# EAGLE design Teensy_3_1 XBee Adapter (EAGLE 7.2.0)
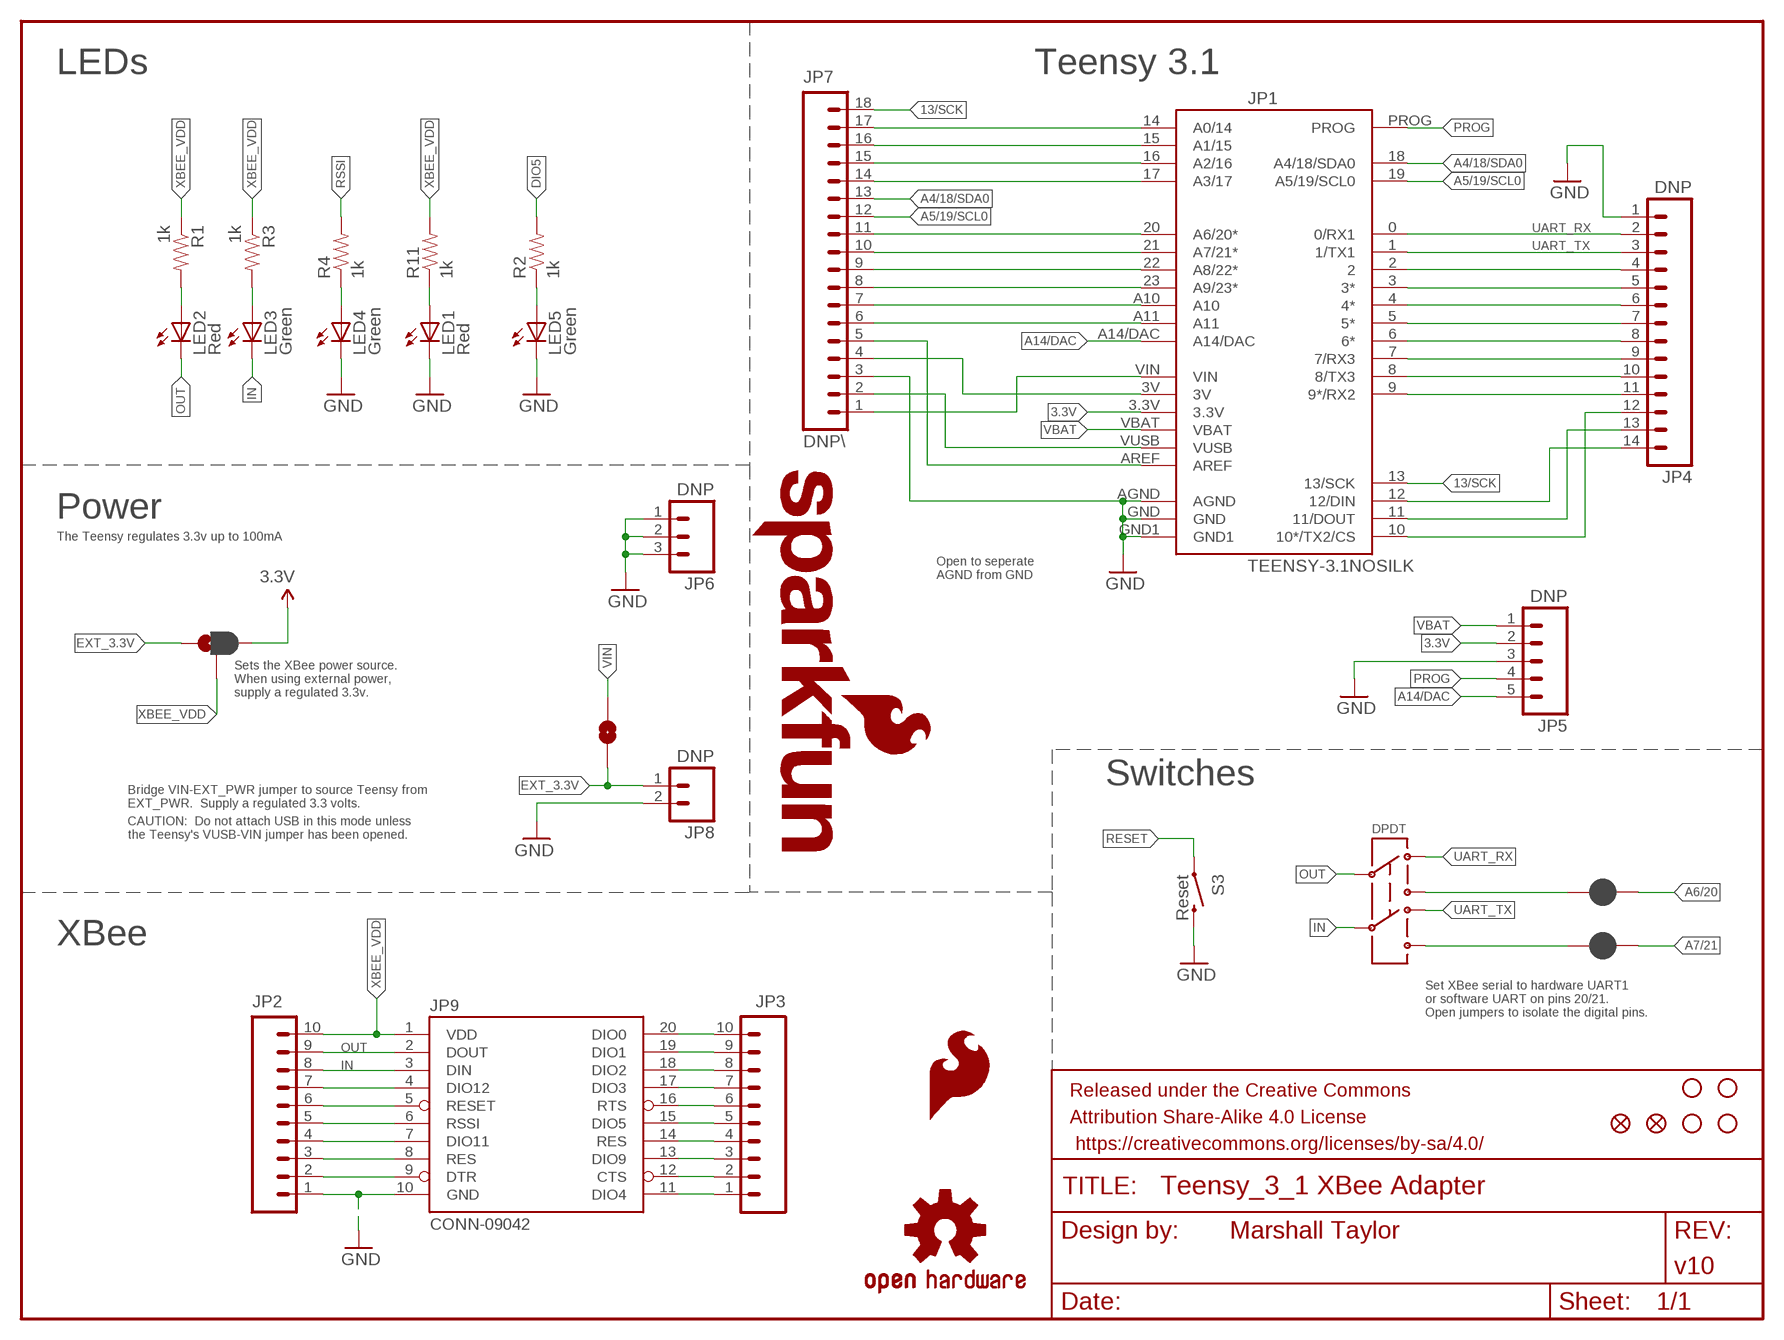
[diagram p0: schematic, sheet 1]

## Parts
FID1  FIDUCIAL1X2  [FIDUCIAL-1X2]
FID2  FIDUCIAL1X2  [FIDUCIAL-1X2]
FRAME1  FRAME-LETTER  [CREATIVE_COMMONS]
JP1  TEENSY-3.1NOSILK  [TEENSY-3.1_NOSILK]
JP2  M10NO_SILK_PTH_FEMALE  [1X10_NO_SILK]
JP3  M10NO_SILK_PTH_FEMALE  [1X10_NO_SILK]
JP4  DNP  M14  [1X14]
JP5  DNP  M05PTH  [1X05]
JP6  DNP  M03PTH  [1X03]
JP7  DNP\  M18_  [1X18]
JP8  DNP  M02PTH  [1X02]
JP9  CONN-09042  XBEE-1B3  [XBEE-SMD]
LED1  Red  LED-RED0603  [LED-0603]
LED2  Red  LED-RED0603  [LED-0603]
LED3  Green  LED-GREEN0603  [LED-0603]
LED4  Green  LED-GREEN0603  [LED-0603]
LED5  Green  LED-GREEN0603  [LED-0603]
LOGO1  SFE_LOGO_FLAME.2_INCH  [SFE_LOGO_FLAME_.2]
LOGO2  OSHW-LOGOM  [OSHW-LOGO-M]
LOGO3  SFE_LOGO_NAME_FLAME.2_INCH  [SFE_LOGO_NAME_FLAME_.2]
R1  1k  1KOHM1/10W1%(0603)  [0603-RES]
R2  1k  1KOHM1/10W1%(0603)  [0603-RES]
R3  1k  1KOHM1/10W1%(0603)  [0603-RES]
R4  1k  1KOHM1/10W1%(0603)  [0603-RES]
R11  1k  1KOHM1/10W1%(0603)  [0603-RES]
S2  DPDT  SWITCH-DPDTAYZ0202  [AYZ0202]
S3  Reset  SWITCH-MOMENTARY-2SMD  [TACTILE-SWITCH-SMD]
SJ1  D_TX  JUMPER-PAD-2-NC_BY_PASTE  [PAD-JUMPER-2-NC_BY_PASTE_YES_SILK]
SJ3  D_RX  JUMPER-PAD-2-NC_BY_PASTE  [PAD-JUMPER-2-NC_BY_PASTE_YES_SILK]
SJ4  JUMPER-PAD-3-2OF3_NC_BY_PASTE  [PAD-JUMPER-3-2OF3_NC_BY_PASTE_YES_SILK_FULL_BOX]
SJ5  EXT_JPR  JUMPER-PAD-2-NOYES_SILK  [PAD-JUMPER-2-NO_YES_SILK]
STANDOFF1  STAND-OFF  [STAND-OFF]
STANDOFF2  STAND-OFF  [STAND-OFF]
STANDOFF3  STAND-OFF  [STAND-OFF]
STANDOFF4  STAND-OFF  [STAND-OFF]

## Nets
2: JP1.2 JP4.4
3: JP1.3(3*) JP4.5
3.3V: JP1.3.3V JP5.2 SJ4.3
3V: JP1.3V JP7.4
4: JP1.4(4*) JP4.6
5: JP1.5(5*) JP4.7
6: JP1.6(6*) JP4.8
7/RX3: JP1.7(7/RX3) JP4.9
8/TX3: JP1.8(8/TX3) JP4.10
9/RX2: JP1.9(9*/RX2) JP4.11
10/TX2/CS: JP1.10(10*/TX2/CS) JP4.12
11/DOUT: JP1.11(11/DOUT) JP4.13
12/DIN: JP1.12(12/DIN) JP4.14
13/SCK: JP1.13(13/SCK) JP7.18
A0/14: JP1.14(A0/14) JP7.17
A1/15: JP1.15(A1/15) JP7.16
A2/16: JP1.16(A2/16) JP7.15
A3/17: JP1.17(A3/17) JP7.14
A4/18/SDA0: JP1.18(A4/18/SDA0) JP7.13
A5/19/SCL0: JP1.19(A5/19/SCL0) JP7.12
A6/20: JP1.20(A6/20*) JP7.11 SJ3.1
A7/21: JP1.21(A7/21*) JP7.10 SJ1.1
A8/22: JP1.22(A8/22*) JP7.9
A9/23: JP1.23(A9/23*) JP7.8
A10: JP1.A10 JP7.7
A11: JP1.A11 JP7.6
A14/DAC: JP1.A14/DAC JP5.5
AREF: JP1.AREF JP7.5
CTS: JP3.2 JP9.12(CTS)
DIO0: JP3.10 JP9.20(DIO0)
DIO1: JP3.9 JP9.19(DIO1)
DIO2: JP3.8 JP9.18(DIO2)
DIO3: JP3.7 JP9.17(DIO3)
DIO4: JP3.1 JP9.11(DIO4)
DIO5: JP3.5 JP9.15(DIO5) R2.2
DIO9: JP3.3 JP9.13(DIO9)
DIO11: JP2.4 JP9.7(DIO11)
DIO12: JP2.7 JP9.4(DIO12)
DTR: JP2.2 JP9.9(DTR)
EXT_3.3V [vcc]: JP8.1 SJ4.1 SJ5.2
GND: JP1.AGND JP1.GND JP1.GND1 JP2.1 JP4.1 JP5.3 JP6.1 JP6.2 JP6.3 JP7.3 JP8.2 JP9.10(GND) LED1.C LED4.C LED5.C S3.3
IN: JP2.8 JP9.3(DIN) LED3.C S2.5
N$12: LED1.A R11.1
N$17: LED2.A R1.2
N$19: LED3.A R3.2
N$43: LED4.A R4.1
N$139: LED5.A R2.1
N$140: S2.6 SJ1.2
N$141: S2.3 SJ3.2
OUT: JP2.9 JP9.2(DOUT) LED2.C S2.2
PROG: JP1.PROG JP5.4
RES: JP2.3 JP9.8(RES)
RES2: JP3.4 JP9.14(RES)
RESET: JP2.6 JP9.5(RESET) S3.1
RSSI: JP2.5 JP9.6(RSSI) R4.2
RTS: JP3.6 JP9.16(RTS)
UART_RX: JP1.0(0/RX1) JP4.2 S2.1
UART_TX: JP1.1(1/TX1) JP4.3 S2.4
VBAT: JP1.VBAT JP5.1
VIN: JP1.VIN JP7.1 SJ5.1
VUSB: JP1.VUSB JP7.2
XBEE_VDD: JP2.10 JP9.1(VDD) R1.1 R3.1 R11.2 SJ4.2

## Notes on the sheet
- LEDs | Teensy 3.1
- Power
- The Teensy regulates 3.3v up to 100mA
- Open to seperate 
  AGND from GND
- Sets the XBee power source.
  When using external power,
  supply a regulated 3.3v.
- Switches
- Bridge VIN-EXT_PWR jumper to source Teensy from
  EXT_PWR.  Supply a regulated 3.3 volts.
- DPDT
- CAUTION:  Do not attach USB in this mode unless
  the Teensy's VUSB-VIN jumper has been opened.
- XBee
- Set XBee serial to hardware UART1
  or software UART on pins 20/21.
  Open jumpers to isolate the digital pins.

## Library data of the parts
FID1 FID2 = SparkFun-Aesthetics:FIDUCIAL: Fiducial Alignment Points Various fiducial points for machine vision alignment.
FRAME1 = SparkFun-Aesthetics:FRAME-LETTER: Schematic Frame Standard 8.5x11 US Letter frame; DESIGNER: Marshall Taylor; VERSION: v10
JP1 = Testing:TEENSY-3.1
JP2 JP3 = SparkFun-Connectors:M10: Header 10 Standard 10-pin 0.1" header. Use with straight break away headers (SKU : PRT-00116), right angle break away headers (PRT-00553), swiss pins (PRT-00743), machine pins (PRT-00117), and female headers (PRT-00115).; PROD_ID: CONN-11563
JP4 = SparkFun-Connectors:M14: Header 14 Standard 14-pin 0.1" header. Use with straight break away headers (SKU : PRT-00116), right angle break away headers (PRT-00553), swiss pins (PRT-00743), machine pins (PRT-00117), and female headers (PRT-00115).
JP5 = SparkFun-Connectors:M05: Header 5 Standard 5-pin 0.1" header. Use with straight break away headers (SKU : PRT-00116), right angle break away headers (PRT-00553), swiss pins (PRT-00743), machine pins (PRT-00117), and female headers (PRT-00115). Molex polarized connector foot print use with SKU : PRT-08230 with associated crimp pins and housings.
JP6 = SparkFun-Connectors:M03: Header 3 Standard 3-pin 0.1" header. Use with straight break away headers (SKU : PRT-00116), right angle break away headers (PRT-00553), swiss pins (PRT-00743), machine pins (PRT-00117), and female headers (PRT-00115). Molex polarized connector foot print use with SKU : PRT-08232 with associated crimp pins and housings.
JP7 = SparkFun-Connectors:M18: 1x18 .1" header
JP8 = SparkFun-Connectors:M02: Standard 2-pin 0.1" header. Use with - straight break away headers ( PRT-00116) - right angle break away headers (PRT-00553) - swiss pins (PRT-00743) - machine pins (PRT-00117) - female headers (PRT-00115) Molex polarized connector foot print use with: PRT-08233 with associated crimp pins and housings. 2.54_SCREWTERM for use with PRT-10571. 3.5mm Screw Terminal footprints for PRT-08084 5mm Screw Terminal footprints for use with PRT-08432
JP9 = SparkFun-RF:XBEE-1: Xbee module footprints; PROD_ID: CONN-09042
LED1 LED2 = SparkFun-LED:LED-RED: Assorted Red LEDs LilyPad 1206- DIO-09912 1206- DIO-00809 0603- DIO-00819; PROD_ID: DIO-00819; VALUE: RED
LED3-LED5 = SparkFun-LED:LED-GREEN: Various green LEDs Green LEDs used in SFE Production 0603- DIO-00821 LARGE- DIO-00862 LILYPAD- DIO-09910; PROD_ID: DIO-00821; VALUE: GREEN
LOGO1 = SparkFun-Aesthetics:SFE_LOGO_FLAME: SFE Logo, flame only This is the SparkFun flame logo. The logo on the schematic will always be the same size; the package variant is the height of the flame. Default layer for the logo on the board is tSilk.
LOGO2 = SparkFun-Aesthetics:OSHW-LOGO: Open Source Hardware Logo This logo indicates the piece of hardware it is found on incorporates a OSHW license and/or adheres to the definition of open source hardware found here: http://freedomdefined.org/OSHW
LOGO3 = SparkFun-Aesthetics:SFE_LOGO_NAME_FLAME: SFE Logo, name and flame This is the SparkFun full logo. The logo on the schematic will always be the same size; the package variant is the height of the flame part of the logo. Default layer for the logo on the board is tSilk.
R1-R4 R11 = SparkFun-Resistors:1KOHM1/10W1%(0603): RES-07856; PROD_ID: RES-07856; VALUE: 1K
S2 = SparkFun-Electromechanical:SWITCH-DPDT: DPDT Version of the COM-00597; PROD_ID: SWCH-08179
S3 = SparkFun-Electromechanical:SWITCH-MOMENTARY-2: Various NO switches- pushbuttons, reed, etc; PROD_ID: SWCH-08247
SJ1 SJ3 = SparkFun-Passives:JUMPER-PAD-2-NC_BY_PASTE
SJ4 = SparkFun-Passives:JUMPER-PAD-3-2OF3_NC_BY_PASTE
SJ5 = SparkFun-Passives:JUMPER-PAD-2-NO
STANDOFF1-STANDOFF4 = SparkFun-Electromechanical:STAND-OFF: #4 Stand Off This is the mechanical footprint for a #4 phillips button head screw. Use the keepout ring to avoid running the screw head into surrounding components. SKU : PRT-00447

## Net classes
0 default: width 0.203 mm
1 vcc: width 0.254 mm

## Board
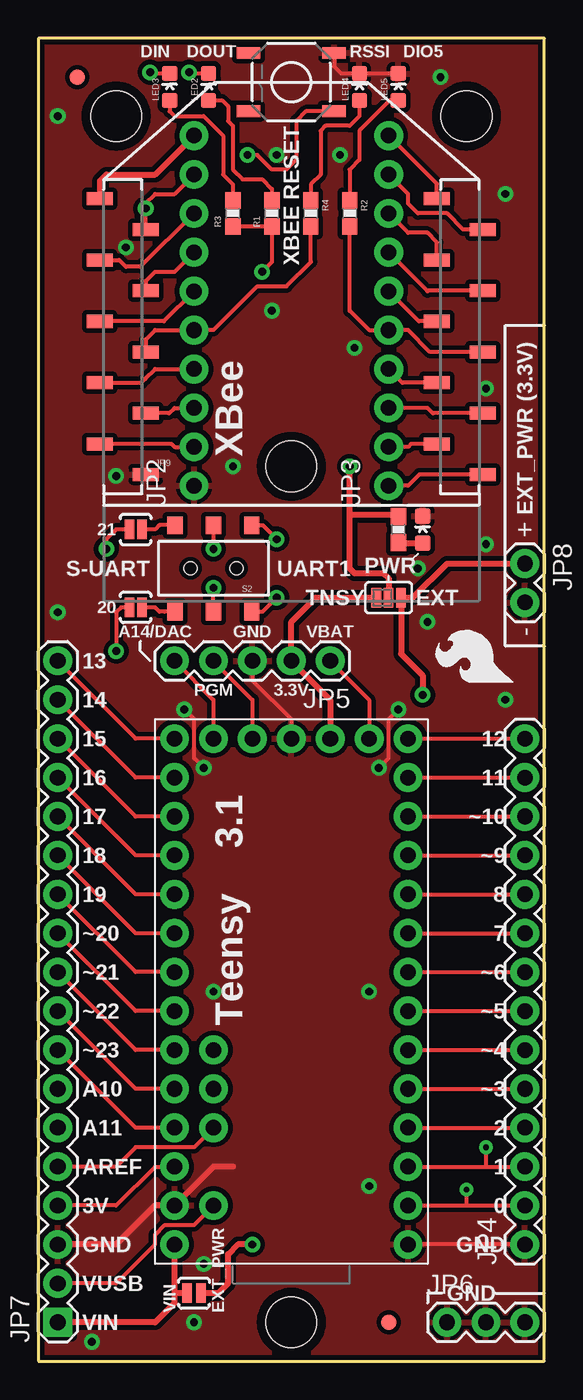
[diagram p1: board, top side]
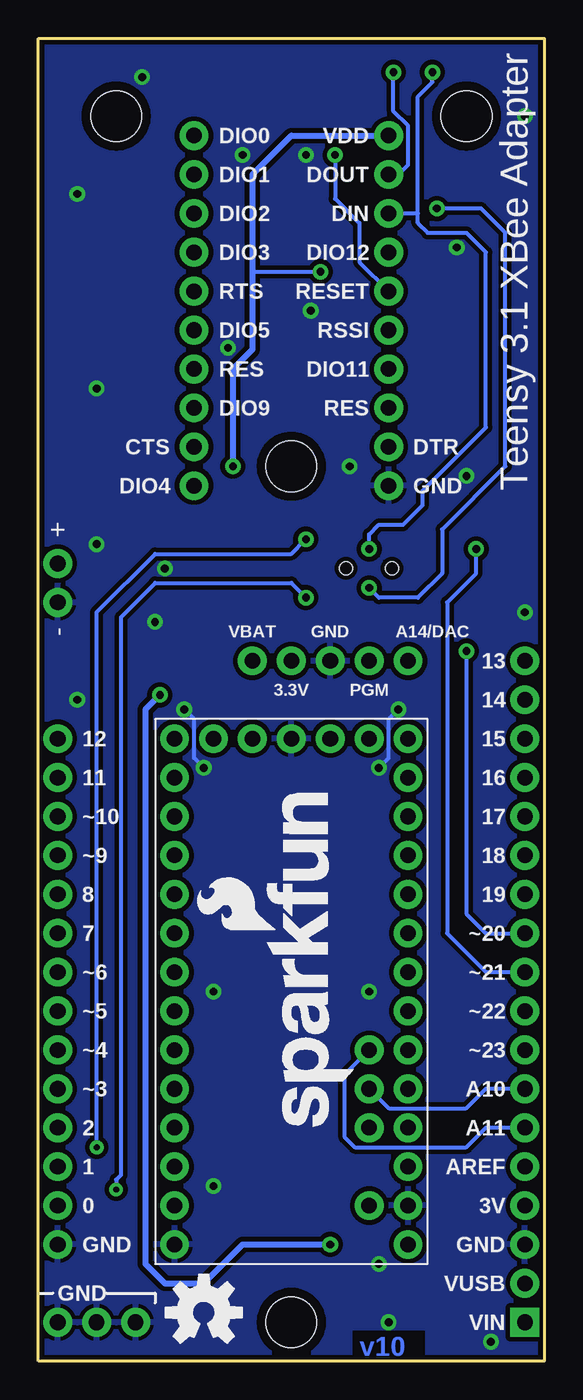
[diagram p2: board, bottom side, seen from below]

Size 33.02 x 86.36 mm. Coordinates in mm from the lower left corner, seen from the top.
Outline: 0,0 33.02,0 33.02,86.36 0,86.36 0,0
Copper layers (1*16): Top 0.035mm / dielectric 1.5mm / Bottom 0.035mm
Design rules "SparkFun-2-layer": minimum track width 7mil, minimum drill 15mil, track to track 8mil, track to pad 8mil, pad to pad 8mil, via to via 8mil, smd to smd 8mil, copper to edge 8mil, drill to drill 8mil, minimum pad ring 12mil, minimum via ring 10mil, stop-mask expansion 4mil, vias tented up to drill 20mil, thermal gap 10mil

### Footprints (pad centres in the part's own frame; a part is rotated, then mirrored left to right if it is on the bottom)
FIDUCIAL-1X2 = smd 1 x 1: 1 0,0
TEENSY-3.1_NOSILK = drill 1.016 pad 1.88: 0 16.51,3.81; 1 16.51,6.35; 2 16.51,8.89; 3 16.51,11.43; 3.3V 11.43,34.29; 3V 1.27,6.35; 4 16.51,13.97; 5 16.51,16.51; 6 16.51,19.05; 7 16.51,21.59; 8 16.51,24.13; 9 16.51,26.67; 10 16.51,29.21; 11 16.51,31.75; 12 16.51,34.29; 13 1.27,34.29; 14 1.27,31.75; 15 1.27,29.21; 16 1.27,26.67; 17 1.27,24.13; 18 1.27,21.59; 19 1.27,19.05; 20 1.27,16.51; 21 1.27,13.97; 22 1.27,11.43; 23 1.27,8.89; A10 3.81,11.43; A11 3.81,13.97; A14/DAC 3.81,34.29; AGND 1.27,3.81; AREF 3.81,8.89; GND 8.89,34.29; GND1 16.51,1.27; PROG 6.35,34.29; VBAT 13.97,34.29; VIN 1.27,1.27; VUSB 3.81,3.81
1X10_NO_SILK = drill 1.016 pad 1.88: 1 0,0; 2 2.54,0; 3 5.08,0; 4 7.62,0; 5 10.16,0; 6 12.7,0; 7 15.24,0; 8 17.78,0; 9 20.32,0; 10 22.86,0
1X14 = drill 1.016 pad 1.88: 1 0,0; 2 2.54,0; 3 5.08,0; 4 7.62,0; 5 10.16,0; 6 12.7,0; 7 15.24,0; 8 17.78,0; 9 20.32,0; 10 22.86,0; 11 25.4,0; 12 27.94,0; 13 30.48,0; 14 33.02,0
1X05 = drill 1.016 pad 1.88: 1 0,0; 2 2.54,0; 3 5.08,0; 4 7.62,0; 5 10.16,0
1X03 = drill 1.016 pad 1.88: 1 0,0; 2 2.54,0; 3 5.08,0
1X18 = drill 1.016 pad 1.88 square: 1 0,0 | drill 1.016 pad 1.88: 2 2.54,0; 3 5.08,0; 4 7.62,0; 5 10.16,0; 6 12.7,0; 7 15.24,0; 8 17.78,0; 9 20.32,0; 10 22.86,0; 11 25.4,0; 12 27.94,0; 13 30.48,0; 14 33.02,0; 15 35.56,0; 16 38.1,0; 17 40.64,0; 18 43.18,0
1X02 = drill 1.016 pad 1.88: 1 0,0; 2 2.54,0
XBEE-SMD = smd 1.7 x 0.85: 1 -12.5,20; 2 -9.5,18; 3 -12.5,16; 4 -9.5,14; 5 -12.5,12; 6 -9.5,10; 7 -12.5,8; 8 -9.5,6; 9 -12.5,4; 10 -9.5,2; 11 12.5,2; 12 9.5,4; 13 12.5,6; 14 9.5,8; 15 12.5,10; 16 9.5,12; 17 12.5,14; 18 9.5,16; 19 12.5,18; 20 9.5,20
LED-0603 = smd 1 x 1: A 0,-0.877; C 0,0.877
0603-RES = smd 1.1 x 1: 1 -0.85,0; 2 0.85,0
AYZ0202 = smd 1 x 1.15: 1 -2.5,2.825; 2 0,2.825; 3 2.5,2.825; 4 -2.5,-2.825; 5 0,-2.825; 6 2.5,-2.825 | hole 0.85: 1.5,0; -1.5,0
TACTILE-SWITCH-SMD = smd 1.524 x 0.762: 1 -2.794,1.905; 2 2.794,1.905; 3 -2.794,-1.905; 4 2.794,-1.905
PAD-JUMPER-2-NC_BY_PASTE_YES_SILK = smd 0.635 x 1.27: 1 -0.401,0; 2 0.413,0
PAD-JUMPER-3-2OF3_NC_BY_PASTE_YES_SILK_FULL_BOX = smd 0.635 x 1.27: 1 -0.813,0; 2 0,0; 3 0.813,0
PAD-JUMPER-2-NO_YES_SILK = smd 0.635 x 1.27: 1 -0.45,0; 2 0.45,0
STAND-OFF = hole 3.302: 0,0

### Placement (x,y rotation side)
FID1  22.86,2.54 0 top
FID2  2.54,83.82 0 top
FRAME1  68.58,34.29 0 top  (outside the outline)
JP1  7.62,6.35 0 top
JP2  10.16,57.15 90 top
JP3  22.86,57.15 90 top
JP4  31.75,7.62 90 top
JP5  19.05,45.72 180 top
JP6  26.67,2.54 0 top
JP7  1.27,2.54 90 top
JP8  31.75,52.07 270 top
JP9  16.51,55.88 0 top
LED1  25.08,54.29 0 top
LED2  11.11,83.19 0 top
LED3  8.57,83.19 0 top
LED4  20.95,83.19 0 top
LED5  23.5,83.19 0 top
LOGO1  31.27,43.97 90 top
LOGO2  22.23,3.17 0 bottom
LOGO3  12.38,14.61 90 bottom
R1  15.24,74.93 90 top
R2  20.32,74.93 270 top
R3  12.7,74.93 90 top
R4  17.78,74.93 270 top
R11  23.5,54.29 90 top
S2  11.43,51.75 180 top
S3  16.51,83.5 180 top
SJ1  6.35,54.29 0 top
SJ3  6.35,49.21 0 top
SJ4  22.86,49.85 180 top
SJ5  10.16,4.45 0 top
STANDOFF1  27.94,81.28 0 top
STANDOFF2  5.08,81.28 0 top
STANDOFF3  16.51,2.54 0 top
STANDOFF4  16.51,58.42 0 top

### Tracks (layer width: path | path; a pad name or v marks a point on that pad's centre or on a via)
2
  Top 0.254: JP1.2 JP4.4
3
  Top 0.254: JP1.3 JP4.5
3.3V
  Top 0.406: JP1.3.3V 19.05,43.18 JP5.2 16.51,48.26 18.1,49.85 SJ4.3
3V
  Top 0.254: JP1.3V 7.62,12.7 5.08,10.16 JP7.4
4
  Top 0.254: JP1.4 JP4.6
5
  Top 0.254: JP1.5 JP4.7
6
  Top 0.254: JP1.6 JP4.8
7/RX3
  Top 0.254: JP1.7 JP4.9
8/TX3
  Top 0.254: JP1.8 JP4.10
9/RX2
  Top 0.254: JP1.9 JP4.11
10/TX2/CS
  Top 0.254: JP1.10 JP4.12
11/DOUT
  Top 0.254: JP1.11 JP4.13
12/DIN
  Top 0.254: JP1.12 JP4.14
13/SCK
  Top 0.254: JP1.13 6.35,40.64 JP7.18
A0/14
  Top 0.254: JP1.14 6.35,38.1 JP7.17
A1/15
  Top 0.254: JP1.15 6.35,35.56 JP7.16
A2/16
  Top 0.254: JP1.16 6.35,33.02 JP7.15
A3/17
  Top 0.254: JP1.17 6.35,30.48 JP7.14
A4/18/SDA0
  Top 0.254: JP1.18 6.35,27.94 JP7.13
A5/19/SCL0
  Top 0.254: JP1.19 6.35,25.4 JP7.12
A6/20  (via drill 0.51)
  Top 0.254: JP1.20 6.35,22.86 JP7.11 | SJ3.1 5.4,49.21 5.08,48.9 v5.08,46.35
  Bottom 0.254: v5.08,46.35 5.08,29.21 3.81,27.94 JP7.11
A7/21  (via drill 0.51)
  Top 0.254: JP1.21 6.35,20.32 JP7.10 | SJ1.1 5.08,54.29 4.45,53.66 v4.45,53.02
  Bottom 0.254: v4.45,53.02 4.45,51.44 6.35,49.53 6.35,27.94 3.81,25.4 JP7.10
A8/22
  Top 0.254: JP1.22 6.35,17.78 JP7.9
A9/23
  Top 0.254: JP1.23 6.35,15.24 JP7.8
A10
  Bottom 0.254: JP1.A10 10.16,16.51 5.08,16.51 4.45,17.14 3.81,17.78 JP7.7
A11
  Bottom 0.254: JP1.A11 13.02,18.73 13.02,14.61 12.38,13.97 5.08,13.97 3.81,15.24 JP7.6
A14/DAC
  Top 0.254: JP5.5 11.43,43.18 JP1.A14/DAC
AREF
  Top 0.254: JP1.AREF 10.16,13.97 6.35,13.97 5.08,12.7 JP7.5
CTS
  Top 0.254: JP3.2 24.13,59.69 24.32,59.88 JP9.12
DIO0
  Top 0.254: JP3.10 26.01,76.86 JP9.20
DIO1
  Top 0.254: JP3.9 24.13,76.2 24.13,75.56 24.77,74.93 26.67,74.93 27.72,73.88 JP9.19
DIO2
  Top 0.254: JP3.8 24.13,73.66 25.4,73.66 26.01,73.05 JP9.18
DIO3
  Top 0.254: 25.43,69.88 25.4,69.85 | 25.43,69.88 25.37,69.88 JP3.7 | JP9.17 25.43,69.88
DIO4
  Top 0.254: JP3.1 24.13,57.15 24.86,57.88 JP9.11
DIO5
  Top 0.254: R2.2 20.32,68.58 21.59,67.31 JP3.5 24.13,67.31 25.56,65.88 JP9.15
DIO9
  Top 0.254: JP3.3 25.4,62.23 25.75,61.88 JP9.13
DIO11
  Top 0.254: JP2.4 7.62,64.77 6.99,64.14 6.73,63.88 JP9.7
DIO12
  Top 0.254: JP2.7 8.89,71.12 7.62,71.12 7.01,70.51 JP9.4
DTR
  Top 0.254: JP2.2 8.89,59.69 8.7,59.88 JP9.9
EXT_3.3V  (via drill 0.51)
  Top 0.406: v25.08,43.5 25.08,44.77 23.67,46.18 SJ4.1 24.45,49.85 26.67,52.07 JP8.1 | v13.97,7.62 13.02,7.62 12.38,6.99 12.38,5.08 11.75,4.45 SJ5.2
  Bottom 0.406: v25.08,43.5 26.04,42.55 26.04,6.35 24.77,5.08 22.23,5.08 19.68,7.62 v13.97,7.62
GND  (via drill 0.51)
  Top 0.254: JP4.1 JP1.GND1 | JP5.3 13.97,44.45 16.51,41.91 JP1.GND | v10.79,38.73 10.16,39.37 10.16,41.91 v9.53,42.55 | v22.23,38.73 22.86,39.37 22.86,41.91 v23.5,42.55 | LED5.C LED4.C 19.76,84.06 19.3,84.52 S3.3
  Top 0.406: 12.7,12.7 11.43,12.7 JP1.AGND 7.62,10.16 5.08,7.62 JP7.3
  Bottom 0.254: v10.79,38.73 10.16,39.37 10.16,41.91 v9.53,42.55 | v22.23,38.73 22.86,39.37 22.86,41.91 v23.5,42.55
  other vias: 10.79,6.35 25.4,48.26 10.16,2.54 1.27,48.9 15.24,68.58 24.77,51.75 1.27,81.28 29.21,63.5 5.08,57.78 20.64,66.15 12.7,58.42 21.59,11.43 19.68,78.74 30.48,76.2 3.49,1.27 21.59,24.13 26.24,83.83 30.48,43.18 29.21,53.34 11.43,24.13 15.56,78.74 5.71,72.71
  pour Top (isolate 0.305): 0,86.36 33.02,86.36 33.02,0 0,0
  pour Bottom (isolate 0.305): 0,86.36 33.02,86.36 33.02,0 12.7,0 12.7,2.22 7.62,2.22 7.62,0 0,0
  pour Bottom (isolate 0.305): 0,86.36 33.02,86.36 33.02,0 12.7,0 12.7,2.22 7.62,2.22 7.62,0 0,0
IN  (via drill 0.51)
  Top 0.254: S2.5 v11.43,53.02 | LED3.C 7.38,84.06 v7.3,84.14 | JP9.3 5.27,71.88 5.71,71.44 6.67,71.44 JP2.8
  Bottom 0.254: v11.43,53.02 11.43,53.98 10.79,54.61 9.21,54.61 7.94,55.88 7.94,56.83 3.81,60.96 3.81,72.39 5.08,73.66 7.62,73.66 8.26,74.3 8.26,74.93 | 8.26,74.93 8.26,82.55 7.3,83.5 v7.3,84.14 | JP2.8 8.26,74.93
N$12
  Top 0.406: R11.1 23.5,53.42 LED1.A
N$17
  Top 0.254: R1.2 15.24,76.52 14.61,77.15 13.34,77.15 12.7,77.79 12.7,80.64 12.38,80.96 12.38,81.92 11.99,82.31 LED2.A
N$19
  Top 0.254: LED3.A 8.57,81.6 8.89,81.28 10.79,81.28 12.06,80.01 12.06,77.47 12.7,76.83 R3.2
N$43
  Top 0.254: LED4.A 20.95,81.28 20.32,80.64 18.73,80.64 18.41,80.33 18.41,77.47 17.78,76.83 R4.1
N$139
  Top 0.254: LED5.A 22.94,82.31 20.95,80.33 20.95,78.42 20.32,77.79 R2.1
N$140
  Top 0.254: SJ1.2 7.62,54.29 7.91,54.58 S2.6
N$141
  Top 0.254: S2.3 8.22,48.93 7.91,48.93 7.62,49.21 SJ3.2
OUT  (via drill 0.51)
  Top 0.254: 10.79,83.82 11.04,84.06 LED2.C 9.92,84.06 v9.84,84.14 | S2.2 v11.43,50.48 | JP2.9 8.89,76.2 7.62,76.2 7.01,75.59 v7.01,75.25 JP9.2
  Bottom 0.254: v7.01,75.25 4.13,75.25 2.54,73.66 2.54,58.42 6.67,54.29 6.67,51.44 8.26,49.85 10.79,49.85 v11.43,50.48 | v9.84,84.14 9.84,81.6 8.89,80.64 8.89,78.11 9.53,77.47 JP2.9
PROG
  Top 0.254: JP5.4 13.97,43.18 JP1.PROG
RES
  Top 0.254: JP2.3 8.89,62.23 8.54,61.88 JP9.8
RES2
  Top 0.254: JP3.4 23.5,64.14 23.75,63.88 JP9.14
RESET  (via drill 0.51)
  Top 0.254: v13.65,78.74 14.29,78.74 15.24,77.79 16.19,77.79 16.83,78.42 16.83,80.96 17.46,81.6 S3.1 | JP2.6 8.19,67.88 JP9.5
  Bottom 0.254: v13.65,78.74 13.65,75.88 12.06,74.3 12.06,71.75 JP2.6
RSSI
  Top 0.254: R4.2 17.78,71.75 16.19,70.17 14.29,70.17 11.43,67.31 JP2.5 7.62,67.31 7.01,66.7 JP9.6
RTS
  Top 0.254: JP3.6 24.83,67.88 JP9.16
UART_RX  (via drill 0.38, 0.51)
  Top 0.254: S2.1 14.64,48.93 v15.56,49.85 | JP1.0 27.94,10.16 | v27.94,11.21 27.94,10.16 | 27.94,10.16 JP4.2
  Bottom 0.254: v15.56,49.85 16.51,50.8 25.4,50.8 27.62,48.58 27.62,12.16 27.94,11.84 v27.94,11.21
UART_TX  (via drill 0.38, 0.51)
  Top 0.254: S2.4 14.64,54.58 v15.56,53.66 | JP1.1 29.21,12.7 | v29.21,13.96 29.21,12.7 | 29.21,12.7 JP4.3
  Bottom 0.254: v29.21,13.96 29.21,48.9 25.4,52.7 16.51,52.7 v15.56,53.66
VBAT
  Top 0.254: JP5.1 21.59,43.18 JP1.VBAT
VIN
  Top 0.406: 8.89,4.45 8.89,3.81 7.62,2.54 JP7.1 | 8.89,4.45 JP1.VIN | SJ5.1 8.89,4.45
VUSB
  Top 0.254: JP1.VUSB 10.16,8.89 8.26,8.89 7.62,8.26 7.62,7.62 5.08,5.08 JP7.2
XBEE_VDD  (via drill 0.51)
  Top 0.254: R3.1 R1.1 15.24,71.75 v14.61,71.12
  Top 0.406: SJ4.2 22.86,51.12 22.54,51.44 20.64,51.44 20.32,51.75 20.32,55.24 | JP2.10 7.62,77.47 4.45,77.47 4.01,77.03 JP9.1 | 20.32,55.24 v20.32,58.42 | R11.2 23.39,55.24 20.32,55.24
  Bottom 0.254: 19.05,71.12 v14.61,71.12
  Bottom 0.406: v20.32,58.42 20.32,64.77 19.05,66.04 19.05,71.12 19.05,77.47 16.51,80.01 JP2.10

### Text on the board
Bottom: v10
tPlace: DIN | DOUT | RSSI | DIO5 | XBEE RESET | XBee | EXT_PWR (3.3V) | 21 | + | S-UART | UART1 | PWR | TNSY | EXT | 20 | A14/DAC | GND | VBAT | - | 13 | PGM | 3.3V | 14 | 15 | 12 | 16 | 11 | 17 | ~10 | 18 | 3.1 | ~9 | 19 | 8 | ~20 | 7 | ~21 | ~6 | ~22 | ~5 | Teensy | ~23 | ~4 | A10 | ~3 | A11 | 2 | AREF | 1 | 3V | 0 | GND | GND | VUSB | GND | VIN | VIN | EXT_PWR
bPlace: Teensy 3.1 XBee Adapter | VDD | DIO0 | DOUT | DIO1 | DIN | DIO2 | DIO12 | DIO3 | RESET | RTS | RSSI | DIO5 | DIO11 | RES | RES | DIO9 | DTR | CTS | GND | DIO4 | + | A14/DAC | GND | VBAT | - | 13 | PGM | 3.3V | 14 | 15 | 12 | 16 | 11 | 17 | ~10 | 18 | ~9 | 19 | 8 | ~20 | 7 | ~21 | ~6 | ~22 | ~5 | ~23 | ~4 | A10 | ~3 | A11 | 2 | AREF | 1 | 3V | 0 | GND | GND | VUSB | GND | VIN
Measures: Units in inches